# Altium schematic sheet Relays_Control.SchDoc
size A4; SheetNumber: 5; SheetTotal: 5
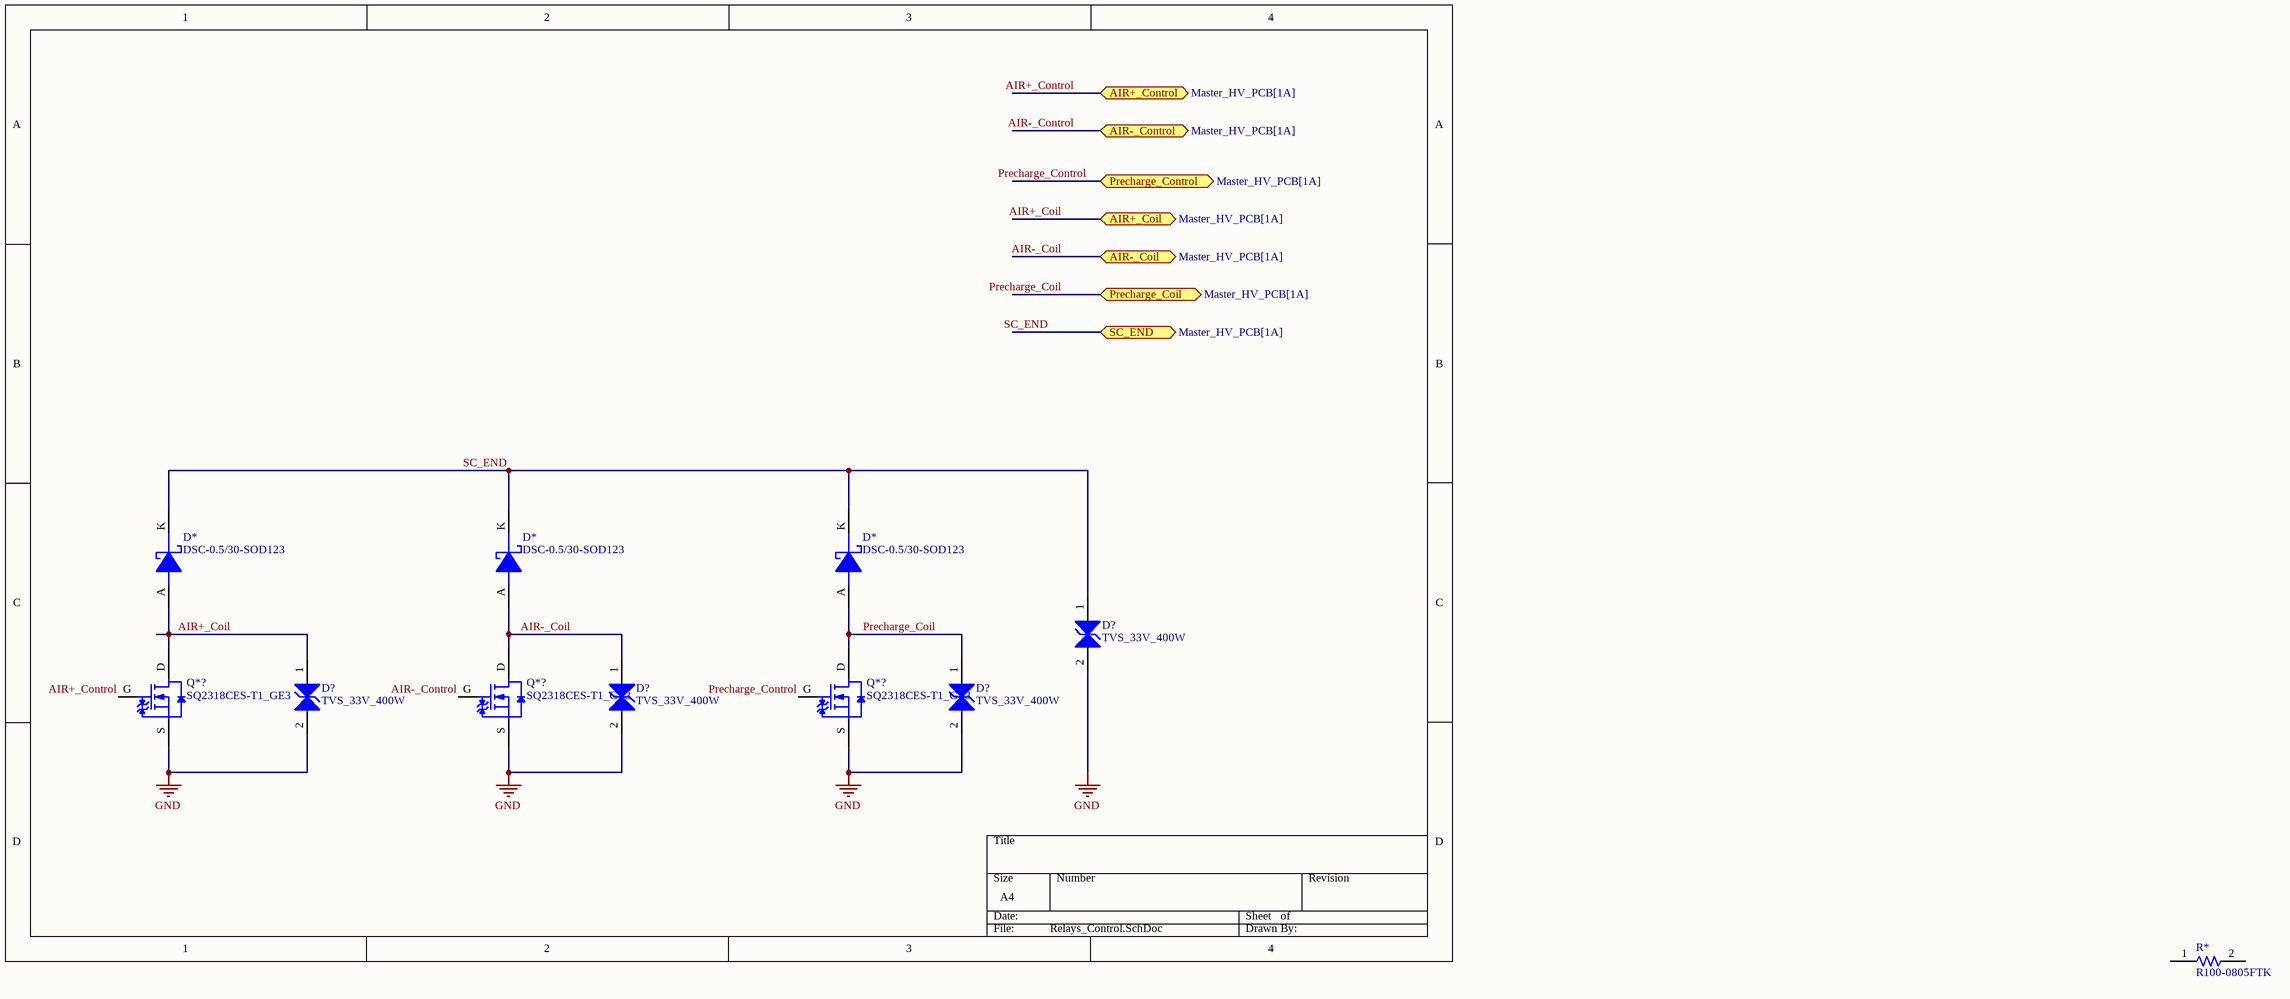
[diagram p0: Relays_Control.SchDoc]

## Parts
(Parts that share a designator on the sheet are numbered #1, #2 ... from top to bottom, then left to right.)
D*#1  DSC-0.5/30-SOD123  [DSC-SOD123]
D*#2  DSC-0.5/30-SOD123  [DSC-SOD123]
D*#3  DSC-0.5/30-SOD123  [DSC-SOD123]
D?#1  TVS_33V_400W  [WE-TVSP_DO-214AC_Bidirectional]
D?#2  TVS_33V_400W  [WE-TVSP_DO-214AC_Bidirectional]
D?#3  TVS_33V_400W  [WE-TVSP_DO-214AC_Bidirectional]
D?#4  TVS_33V_400W  [WE-TVSP_DO-214AC_Bidirectional]
Q*?#1  SQ2318CES-T1_GE3  [SOT95P245X110-3N]
Q*?#2  SQ2318CES-T1_GE3  [SOT95P245X110-3N]
Q*?#3  SQ2318CES-T1_GE3  [SOT95P245X110-3N]
R*  R100-0805FTK  [R0805FTK]

## Ports
AIR+_Coil (bidir, see Master_HV_PCB[1A]), AIR+_Control (bidir, see Master_HV_PCB[1A]), AIR-_Coil (bidir, see Master_HV_PCB[1A]), AIR-_Control (bidir, see Master_HV_PCB[1A]), Precharge_Coil (bidir, see Master_HV_PCB[1A]), Precharge_Control (bidir, see Master_HV_PCB[1A]), SC_END (bidir, see Master_HV_PCB[1A])

## Nets
GND: D?#1.2 D?#2.2 D?#3.2 D?#4.2 Q*?#1.S Q*?#2.S Q*?#3.S
AIR+_Coil: D*#1.A D?#2.1 Q*?#1.D ; port AIR+_Coil
AIR+_Control: Q*?#1.G ; port AIR+_Control
AIR-_Coil: D*#2.A D?#3.1 Q*?#2.D ; port AIR-_Coil
AIR-_Control: Q*?#2.G ; port AIR-_Control
Precharge_Coil: D*#3.A D?#4.1 Q*?#3.D ; port Precharge_Coil
Precharge_Control: Q*?#3.G ; port Precharge_Control
SC_END: D*#1.K D*#2.K D*#3.K D?#1.1 ; port SC_END

Not connected (* = marked no-connect by the designer): R* 1 2

## Library data of the parts
D*#1-D*#3 = CMP-00165-1: VR=30V IF=500mA 30pF P=410mW; Max Reverse Leakage Current: 130uA; .Creator: GP; Max Reverse Voltage (DC): 30V; Element Configuration: Single; Average Rectified Current: 500mA; Peak Non-Repetitive Surge Current: 5.5A; Polarity: Standard; Forward Voltage: 430mV; ComponentLink10Description: https://datasheet.ciiva.com/910/mbr0530-910518.pdf?src-supplier=Digi-Key; ComponentLink1Description: Datasheet; Category: Diode; ComponentLink3Description: https://datasheet.ciiva.com/30479/0900766b810e2512-30479401.pdf?src-supplier=RSComponents; ComponentLink5Description: https://datasheet.ciiva.com/910/mbr0530-910516.pdf?src-supplier=Digi-Key; Stock 1: 9; Weight: 0.03g; Source: Filter components.SchLib; ComponentLink2Description: Where buy it; Series: -; Mount: Surface Mount; Max Repetitive Reverse Voltage (Vrrm): 30V; Pricing 1: 1=0,34400, 10=0,23900, 100=0,12200, 500=0,10000 (USD); Design Item ID: DSC-0.5/30-SOD123; ComponentLink8Description: https://datasheet.ciiva.com/17318/mbr0530-17318568.pdf?src-supplier=Future+Electronics; Current Rating: 500mA; ComponentLink1URL: *; Length: 2.7mm; Max Reverse Current: 130uA; ComponentLink7URL: https://datasheet.ciiva.com/8300/mbr0530-8300905.pdf?src-supplier=Avnet; ComponentLink9URL: https://datasheet.ciiva.com/15144/getdatasheetpartid-86760-15144598.pdf?src-supplier=Verical; Radiation Hardening: No; Height: 1.03mm; ComponentLink4Description: https://datasheet.ciiva.com/34301/974753-34301826.pdf?src-supplier=Jameco; ComponentLink7Description: https://datasheet.ciiva.com/8300/mbr0530-8300905.pdf?src-supplier=Avnet; Package Quantity: 1; Forward Current: 500mA; ComponentLink5URL: https://datasheet.ciiva.com/910/mbr0530-910516.pdf?src-supplier=Digi-Key; Max Surge Current: 5.5A; Lead Free: Lead Free; ComponentLink2URL: *; Max Forward Surge Current (Ifsm): 5.5A; Output Current: 500mA; Voltage Rating (DC): 30V; Contact Plating: Tin,Matte; RoHS Compliant: Yes; REACH SVHC: No SVHC; ComponentLink10URL: https://datasheet.ciiva.com/910/mbr0530-910518.pdf?src-supplier=Digi-Key; ComponentLink4URL: https://datasheet.ciiva.com/34301/974753-34301826.pdf?src-supplier=Jameco; ComponentLink6URL: https://datasheet.ciiva.com/25931/mbr0530-25931989.pdf?src-supplier=Avnet+Europe; ComponentLink6Description: https://datasheet.ciiva.com/25931/mbr0530-25931989.pdf?src-supplier=Avnet+Europe; Width: 1.6mm; ComponentLink3URL: https://datasheet.ciiva.com/30479/0900766b810e2512-30479401.pdf?src-supplier=RSComponents; ComponentLink9Description: https://datasheet.ciiva.com/15144/getdatasheetpartid-86760-15144598.pdf?src-supplier=Verical; ComponentLink8URL: https://datasheet.ciiva.com/17318/mbr0530-17318568.pdf?src-supplier=Future+Electronics
D?#1-D?#4 = CMP-004-00003-1: Trans Voltage Suppressor Diode, 400W, Bidirectional, 1 Element, Silicon, DO-214AC; Min Operating Temperature: -65°C; Pins: 2; RoHS Compliant: Yes; Max Operating Temperature: 150°C
Q*?#1-Q*?#3 = CMP-013-00002-1: Mosfet, N-channel, 40V, 7A, SOT-23 Rohs Compliant: Yes
R* = CMP-00083-1: Res Thick Film 0805 100 Ohm 1% 1/8W ±100ppm/°C Molded SMD SMD Paper Tape on Plastic Reel; Manufacturer Part Number 1: CR0805-FX-1000ELF; Manufacturer 1: Bourns; Power Rating: 125mW; Voltage Rating (DC): 150V; .Creator: DR; Value: 100; Military Standard: Not; Radiation Hardening: No; Max Operating Temperature: 155°C; Packaging: Tape and Reel; ComponentLink3Description: https://datasheet.ciiva.com/6547/chpreztr-6547414.pdf?src-supplier=Digi-Key; RoHS Compliant: Yes; ComponentLink5Description: https://datasheet.ciiva.com/9120/chpreztr-9120744.pdf?src-supplier=Avnet; ComponentLink4URL: https://datasheet.ciiva.com/6547/chpreztr-6547415.pdf?src-supplier=Digi-Key; REACH SVHC: No SVHC; Depth: 1.25mm; Case/Package: 0805; Series: CR0805; Pricing 1: 1=0,05840, 10=0,03430, 25=0,01780, 100=0,00750, 250=0,00560, 500=0,00490, 3000=0,00470 (USD); Features: Moisture Resistant; Design Item ID: R100-0805FTK; Resistor Type: Thick Film; ComponentLink3URL: https://datasheet.ciiva.com/6547/chpreztr-6547414.pdf?src-supplier=Digi-Key; Construction: Rectangular; Width: 1.25mm; ComponentLink4Description: https://datasheet.ciiva.com/6547/chpreztr-6547415.pdf?src-supplier=Digi-Key; Stock 1: 49802; ComponentLink1URL: https://datasheet.ciiva.com/11809/0900766b80fcdb72-11809178.pdf?src-supplier=RSComponents; Number of Terminations: 2; ComponentLink1Description: https://datasheet.ciiva.com/11809/0900766b80fcdb72-11809178.pdf?src-supplier=RSComponents; Length: 2mm; Min Operating Temperature: -55°C; Height: 0.5mm; Mount: Surface Mount; Max Power Dissipation: 125mW; Technology: THICK FILM; Case Code (Metric): 2012; Tolerance: 1%; Category: Chip SMD Resistors; Thickness: 508um; Source: Passives.SchLib; Resistance Tolerance: 1%; RoHS: Yes; ComponentLink5URL: https://datasheet.ciiva.com/9120/chpreztr-9120744.pdf?src-supplier=Avnet; Temperature Coefficient: 100ppm/°C; Package Quantity: 1; Pins: 2; Contact Plating: Tin; Voltage Rating: 150V; Termination: SMD/SMT; ComponentLink2Description: https://datasheet.ciiva.com/6547/chpreztr-6547413.pdf?src-supplier=Digi-Key; ComponentLink2URL: https://datasheet.ciiva.com/6547/chpreztr-6547413.pdf?src-supplier=Digi-Key